# EasyEDA Pro project 接口板.eprj

# Schematic Schematic1
Create Date: 2024-05-16; Page Name: P1; Project Name: 接口板; Schematic Name: Schematic1; Update Date: 2024-05-16; Company: 嘉立创EDA; Page Size: A4; Version: V1.0
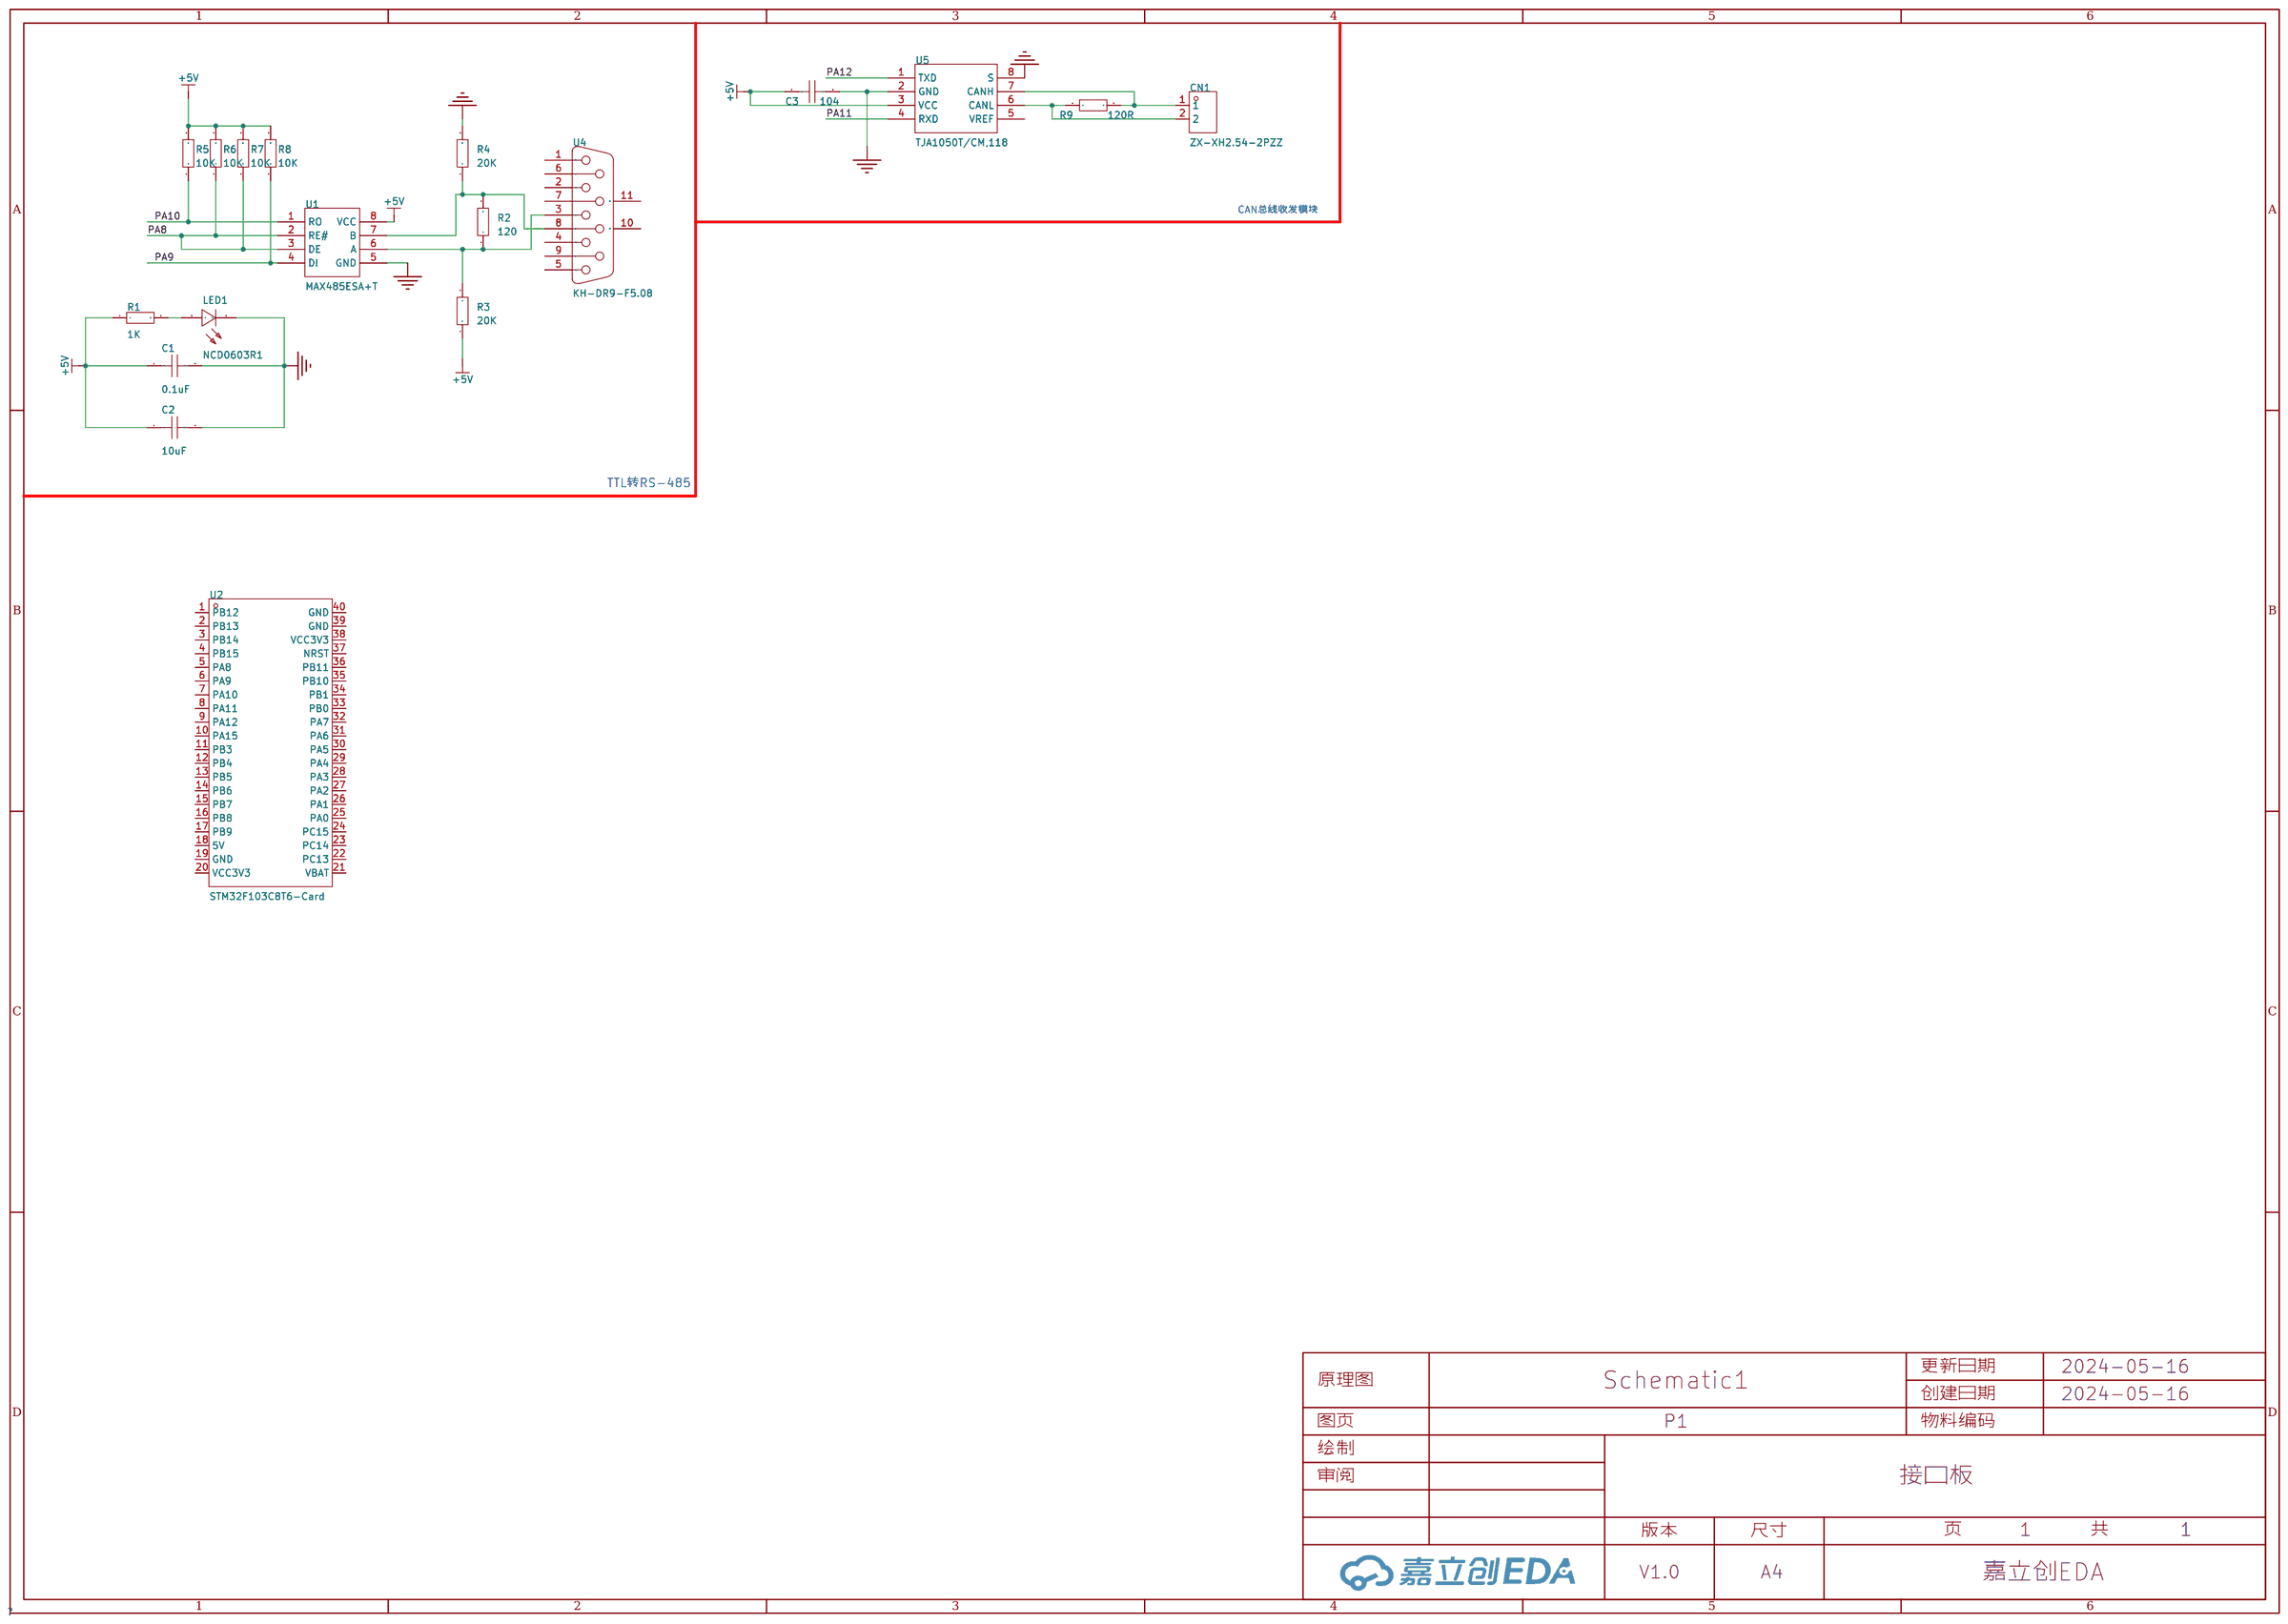
[diagram p0: schematic sheet]

## Parts
C1  0.1uF  [C0603]
C2  10uF  [C0603]
C3  104  [C0603]
CN1  ZX-XH2.54-2PZZ  [CONN-TH_2P-P2.50_HX25003-2A]
LED1  NCD0603R1  [LED0603-RD_RED]
R1  1K  [R0603]
R2  120  [R0603]
R3  20K  [R0603]
R4  20K  [R0603]
R5  10K  [R0603]
R6  10K  [R0603]
R7  10K  [R0603]
R8  10K  [R0603]
R9  120R  [R0603]
U1  MAX485ESA+T  [SOIC-8_L5.0-W4.0-P1.27-LS6.0-BL]
U2  STM32F103C8T6-Card  [CONN-TH_L53.3-W22.9_STM32F103C8T6-CARD]
U4  KH-DR9-F5.08  [DB9-TH_KH-DR9-F5.08]
U5  TJA1050T/CM,118  [SOIC-8_L5.0-W4.0-P1.27-LS6.0-BL]

## Library data of the parts
C1-C3 = CAP_0603: Supplier Footprint: 0603
CN1 = ZX-XH2.54-2PZZ: 插针结构:1x2P;间距:2.54mm;安装方式:直插;参考系列:XH;总PIN数:2P;排数:1;每排PIN数:2;行距:-;额定电流:3A;触头材质:黄铜;触头镀层:锡;工作温度范围:-25℃~+85℃;; Supplier Part: C7429632; Manufacturer: Megastar(兆星); Supplier Footprint: 插件,P=2.54mm; JLCPCB Part Class: 扩展库; Datasheet: https://atta.szlcsc.com/upload/public/pdf/source/20230619/19BA6947230AA44A04D3EDD65E618FD0.pdf; Supplier: LCSC; Pins Structure: 1x2P; Pitch: 2.54mm; Mounting Style: 直插; Reference Series: XH; Number of Pins: 2P; Number of Rows: 1; Number of PINs Per Row: 2; Current Rating (Max): 3A; Contact Material: 黄铜; Contact Plating: 锡; Operating Temperature Range: -25℃~+85℃
LED1 = NCD0603R1_C84263: 灯头类型:-;发光颜色:红色;正向电压(VF):1.6V~2.6V;功率:65mW;正向电流:20mA;主波长:615nm~630nm;二极管配置:独立二极管;透镜颜色:无色透明透镜;色温:-;发光强度:80mcd~220mcd;发光角度:130°;载带方式:-;工作温度:-30℃~+85℃;; Supplier Part: C84263; Manufacturer: 国星光电; Supplier Footprint: 0603; JLCPCB Part Class: 扩展库; Datasheet: https://atta.szlcsc.com/upload/public/pdf/source/20200820/C84263_DABC6A75E58F576973B407FDBA283D60.pdf; Supplier: LCSC; Emitted Color: 红色; Forward Voltage (VF): 1.6V~2.6V; Power Dissipation: 65mW; Forward Current: 20mA; Dominant Wavelength: 615nm~630nm; Diode Configuration: 独立二极管; Lens Color: 无色透明透镜; Luminous Intensity: 80mcd~220mcd; Viewing Angle: 130°; Operating Temperature: -30℃~+85℃
R1-R9 = Res_0603: Supplier Footprint: 0603
U1 = MAX485ESA+T: 类型:收发器;数据速率:2.5Mbps;驱动器/接收器:1/1;; LCSC Part Name: 5V供电 2.5Mbps 收发器; Supplier Part: C19738; Manufacturer: ADI(亚德诺)/MAXIM(美信); Supplier Footprint: SOIC-8; JLCPCB Part Class: 扩展库; Datasheet: https://atta.szlcsc.com/upload/public/pdf/source/20140614/1457707090366.pdf; Supplier: LCSC; Types: 收发器; Supply Voltage: 4.75V~5.25V; Data Rate: 2.5Mbps; Driver/receiver: 1/1; Operating Temperature: -40℃~+85℃
U2 = STM32F103C8T6-Card: Supplier Part: C9900077949; Supplier Footprint: 插件; JLCPCB Part Class: Extended Part; Supplier: LCSC
U4 = KH-DR9-F5.08: 连接器类型:D-Sub;公母:母;总PIN位数:9P;; LCSC Part Name: D-Sub 母 P数:9P; Supplier Part: C4943312; Manufacturer: kinghelm(金航标); Supplier Footprint: 插件; JLCPCB Part Class: 扩展库; Datasheet: https://atta.szlcsc.com/upload/public/pdf/source/20220712/6806968AA8A54D76BDE156883DAEC9A1.pdf; Supplier: LCSC; Connector Type: D-Sub; Gender: 母; Number of Pins: 9P
U5 = TJA1050T/CM,118: 类型:收发器;; LCSC Part Name: 4.75V~5.25V; Supplier Part: C6952; Manufacturer: NXP(恩智浦); Supplier Footprint: SOP-8; JLCPCB Part Class: 扩展库; Datasheet: https://atta.szlcsc.com/upload/public/pdf/source/20140411/1457707042917.pdf; Supplier: LCSC; Type: 收发器; Supply Voltage: 4.75V~5.25V; Supply Current: 50mA

## Nets
+5V: C1.1 C2.1 C3.1 R1.1 R3.1 R5.2 R6.2 R7.2 R8.2 U1.8(VCC) U5.3(VCC)
GND: C1.2 C2.2 C3.2 LED1.1(K) R4.2 U1.5(GND) U5.2(GND) U5.8(S)
PA8: R6.1 R7.1 U1.2(RE#) U1.3(DE)
PA9: R8.1 U1.4(DI)
PA10: R5.1 U1.1(RO)
PA11: U5.4(RXD)
PA12: U5.1(TXD)
Net-(CN1-1): CN1.1 R9.2 U5.7(CANH)
Net-(CN1-2): CN1.2 R9.1 U5.6(CANL)
Net-(LED1-2): LED1.2(A) R1.2
Net-(R2-1): R2.1 R3.2 U1.6(A) U4.3
Net-(R2-2): R2.2 R4.1 U1.7(B) U4.8

Not connected (* = marked no-connect by the designer): U2 1(PB12) 2(PB13) 3(PB14) 4(PB15) 5(PA8) 6(PA9) 7(PA10) 8(PA11) 9(PA12) 10(PA15) 11(PB3) 12(PB4) 13(PB5) 14(PB6) 15(PB7) 16(PB8) 17(PB9) 18(5V) 19(GND) 20(VCC3V3) 21(VBAT) 22(PC13) 23(PC14) 24(PC15) 25(PA0) 26(PA1) 27(PA2) 28(PA3) 29(PA4) 30(PA5) 31(PA6) 32(PA7) 33(PB0) 34(PB1) 35(PB10) 36(PB11) 37(NRST) 38(VCC3V3) 39(GND) 40(GND); U4 1 2 4 5 6 7 9 10(MH1) 11(MH2); U5 5(VREF)

## Notes on the sheet
- CAN总线收发模块
- TTL转RS-485
